# EAGLE design ray0 (EAGLE 9.5.1)
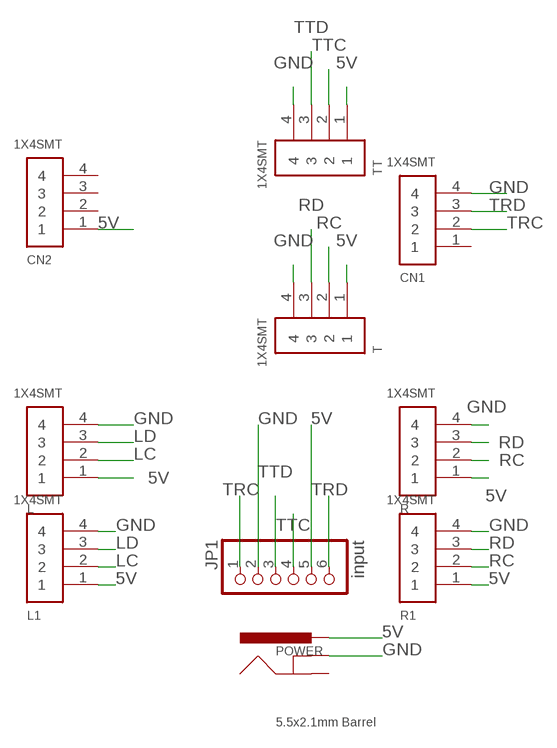
[diagram p0: schematic, sheet 1]

## Parts
CN1  1X4SMT  [1X4-SMT]
CN2  1X4SMT  [1X4-SMT]
JP1  input  PINHD-1X6  [1X06]
L  1X4SMT  [1X4-SMT]
L1  1X4SMT  [1X4-SMT]
POWER  5.5x2.1mm Barrel  POWER_JACKSMD  [POWER_JACK_SMD]
R  1X4SMT  [1X4-SMT]
R1  1X4SMT  [1X4-SMT]
T  1X4SMT  [1X4-SMT]
TT  1X4SMT  [1X4-SMT]

## Nets
5V: CN2.1 JP1.5 L1.1 L.1 POWER.VIN0(PWR) POWER.VIN1(PWR) R1.1 R.1 T.1 TT.1
GND: CN1.4 JP1.2 L1.4 L.4 POWER.GND(GNDBREAK) R1.4 R.4 T.4 TT.4
LC: L1.2 L.2
LD: L1.3 L.3
RC: R1.2 R.2 T.2
RD: R1.3 R.3 T.3
TRC: CN1.2 JP1.1
TRD: CN1.3 JP1.6
TTC: JP1.4 TT.2
TTD: JP1.3 TT.3
Unconnected: CN1.1 CN2.2 CN2.3 CN2.4 POWER.P$4(GND)

## Library data of the parts
CN1 CN2 L L1 R R1 T TT = adafruit:1X4: 4-pin connector
JP1 = pinhead:PINHD-1X6: PIN HEADER
POWER = SparkFun-Connectors:POWER_JACK: Power Jack Connector This is the standard 5.5mm barrel jack for power. The PTH is the most common, proven, reliable, footprint. The Slot footprint only works if the mill layer is transmitted to the PCB fab house so be warned. Here are the connectors we sell at SparkFun: DC Barrel Power Jack/Connector <https://www.sparkfun.com/products/119> (PRT-00119) DC Barrel Power Jack/Connector (SMD) <https://www.sparkfun.com/products/12748> (PRT-12748) DC Barrel Jack Adapter - Breadboard Compatible <https://www.sparkfun.com/products/10811> (PRT-10811) It is used on this SparkFun product (and many, many others): SparkFun RedBoard - Programmed with Arduino <https://www.sparkfun.com/products/12757> (DEV-12757) Also, if you need a mating power supply or connector, please check these out: Wall Adapter Power Supply - 9VDC 650mA <https://www.sparkfun.com/products/298> (TOL-00298) DC Barrel Jack Adapter - Male <https://www.sparkfun.com/products/10287> (PRT-10287); PROD_ID: CONN-08106; SF_ID: PRT-12748

## Board
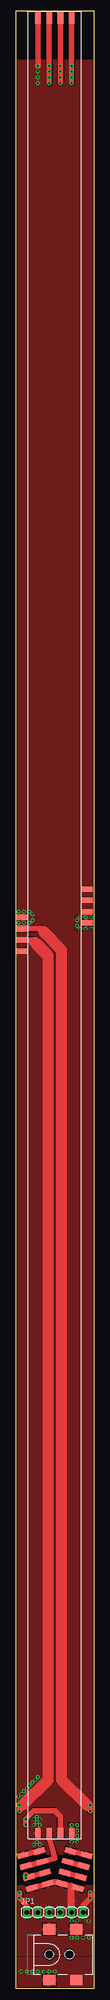
[diagram p1: board, top side]
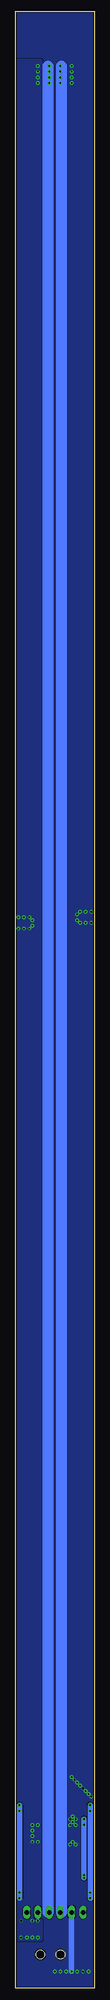
[diagram p2: board, bottom side, seen from below]

Size 17.78 x 445.45 mm. Coordinates in mm from the lower left corner, seen from the top.
Outline: 0,0 17.78,0 17.78,445.45 0,445.45 0,0
Copper layers (1*16): Top 0.035mm / dielectric 1.5mm / Bottom 0.035mm
Design rules "default *": minimum track width 6mil, minimum drill 0.35mm, track to track 6mil, track to pad 6mil, pad to pad 6mil, via to via 6mil, smd to smd 6mil, copper to edge 10mil, drill to drill 6mil, minimum pad ring 10mil, minimum via ring 8mil, stop-mask expansion 4mil, vias tented up to drill 14mil, thermal gap 10mil

### Footprints (pad centres in the part's own frame; a part is rotated, then mirrored left to right if it is on the bottom)
1X4-SMT = smd 1.27 x 2.54: 1 -3.81,0; 2 -1.27,0; 3 1.27,0; 4 3.81,0
1X06 = drill 1.016 long: 1 -6.35,0; 2 -3.81,0; 3 -1.27,0; 4 1.27,0; 5 3.81,0; 6 6.35,0
POWER_JACK_SMD = smd 2.8 x 2.4: GND 0,-5.7; P$4 6.1,-5.7; VIN0 0,5.7; VIN1 6.1,5.7 | hole 2.032: 0,0; 4.572,0

### Placement (x,y rotation side)
CN1  1.52,237.49 90 top
CN2  16.26,243.84 90 top
JP1  8.89,17.14 0 top
L  11.43,27.3 75 top
L1  15.11,26.32 75 top
POWER  7.62,7.62 0 top
R  6.35,27.3 105 top
R1  2.67,26.32 105 top
T  8.89,34.92 180 top
TT  8.89,443.93 180 top

### Tracks (layer width: path | path; a pad name or v marks a point on that pad's centre or on a via)
5V  (via drill 0.35)
  Top 1.27: TT.1 v12.7,433.07 v12.7,431.8 v12.7,430.53 v12.7,429.26 | R1.1 R.1 8.89,24.04 L.1 L1.1
  Top 1.524: JP1.5 12.7,19.68 12.7,23.02
  other vias: 12.7,11.43 13.97,11.43 15.24,11.43 16.51,15.24 13.97,15.24 12.7,15.24 16.51,11.43 13.97,240.66 13.97,239.4 14.61,238.76 15.88,238.76 17.14,238.76 14.61,241.3 15.88,241.3 17.14,241.3 12.7,36.83 13.97,36.83 13.97,35.56 13.97,34.29 12.7,33.02 13.97,33.02
  pour Top: 17.78,7.62 0,7.62 0,23.24 17.78,23.24
  pour Top: 17.78,7.62 0,7.62 0,22.99 17.78,22.99
  pour Top: 14.1,32.89 14.1,36.96 12.19,36.96 12.19,32.89
  pour Top: 13.84,238.63 13.84,241.43 17.78,241.43 17.78,238.63
  pour Bottom: 17.78,10.92 11.94,10.92 11.94,434.34 17.78,434.34
  pour Bottom: 17.78,10.92 11.94,10.92 11.94,434.34 17.78,434.34
GND  (via drill 0.35)
  Top 1.27: TT.4 v5.08,433.07 | R1.4 R.4 | L1.4 L.4
  Bottom 1.27: JP1.2 v5.08,3.81
  other vias: 1.27,43.81 1.91,44.45 2.54,45.09 3.17,45.72 3.81,46.35 4.45,46.99 4.83,37.47 6.35,3.81 7.62,3.81 8.89,3.81 1.27,3.81 2.54,3.81 3.81,3.81 5.46,38.1 5.46,36.83 4.19,36.83 4.19,38.1 4.83,38.73 5.08,47.62 0.64,43.18 4.83,33.02 4.19,32.38 5.46,32.38 5.08,431.8 5.08,430.53 5.08,429.26 0.64,240.03 1.91,240.03 3.17,240.03 0.64,242.57 1.91,242.57 3.17,242.57 3.81,241.94 3.81,240.66
  pour Bottom (rank 2): 0,0 17.78,0 17.78,445.45 0,445.45
  pour Bottom (rank 2): 0,0 17.78,0 17.78,445.45 0,445.45
  pour Top (rank 2): 0,30.48 17.78,30.48 17.78,243.84 0,243.84
  pour Top (rank 2): 0,30.48 17.78,30.48 17.78,434.34 0,434.34
  pour Top (rank 2): 0,0 17.78,0 17.78,7.62 0,7.62
  pour Top (rank 2): 0,0 17.78,0 17.78,7.62 0,7.62
LC
  Top 1.27: L1.2 L.2
LD
  Top 1.27: L1.3 L.3
RC  (via drill 0.35)
  Top 0.152: R1.2 2.62,25.09 v2.31,25.54
  Top 1.27: T.2 10.16,38.73 8.89,40.01 4.06,40.01 v2.31,38.12 v2.31,36.85 | R1.2 R.2 | v2.31,25.54 v2.31,24.91
  Bottom 1.27: v2.31,38.12 v2.31,24.91
  pour Top: 9.4,33.53 10.92,33.53 10.92,36.32 9.4,36.32
RD
  Top 1.27: T.3 7.62,34.04 8.89,29.3 R.3 R1.3
  pour Top: 6.86,33.53 8.38,33.53 8.38,36.32 6.86,36.32
TRC  (via drill 0.35)
  Top 0.152: v0.89,41.27 0.95,41.27 | 0.95,41.27 1.52,41.27 | 0.89,41.21 0.95,41.27
  Top 1.27: CN1.2 4.45,236.22 4.45,235.59 | v0.89,40.01 0.89,41.21 | v0.89,21.59 v0.89,20.32 2.54,18.67 JP1.1
  Top 2.54: 1.52,41.27 7.37,46.99 7.37,232.66 4.45,235.59
  Bottom 1.27: v0.89,41.27 v0.89,20.32
TRD  (via drill 0.35)
  Top 0.152: v16.89,41.27 16.26,41.27
  Top 1.27: CN1.3 6.35,238.76 6.35,238.12 | JP1.6 15.24,18.67 v16.89,20.32 v16.89,21.59 | v16.89,41.27 v16.89,40.01
  Top 2.54: 6.35,238.12 10.41,233.93 10.41,46.99 16.26,41.27
  Bottom 1.27: v16.89,41.27 v16.89,20.32
TTC  (via drill 0.35)
  Top 1.27: TT.2 v10.16,433.07 v10.16,431.8 v10.16,430.53 v10.16,429.26
  Bottom 1.27: JP1.4 10.41,17.14 | v10.16,433.07 10.41,433.07
  Bottom 2.54: 10.41,433.07 10.41,17.14
TTD  (via drill 0.35)
  Top 1.27: TT.3 v7.62,433.07 v7.62,431.8 v7.62,430.53 v7.62,429.26
  Bottom 1.27: JP1.3 7.37,17.14 | v7.62,429.26 v7.62,433.07 7.37,433.07
  Bottom 2.54: 7.37,433.07 7.37,17.14